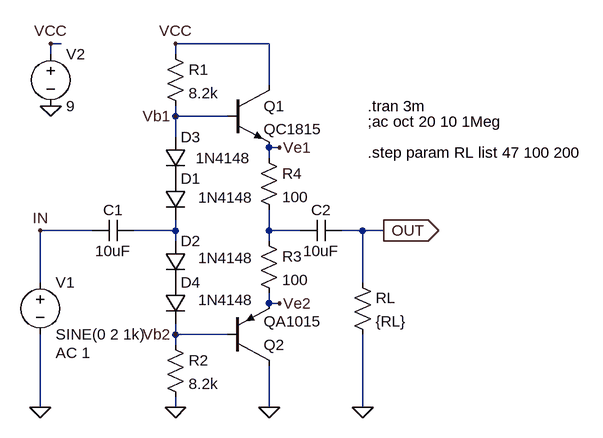
[diagram p0: schematic Push-Pull_Diode_x2_Offset.asc]
Push-Pull_Diode_x2_Offset.asc, the LTspice schematic file:
Version 4
SHEET 1 880 680
WIRE -32 -112 -48 -112
WIRE 288 -112 144 -112
WIRE -48 -96 -48 -112
WIRE 144 -96 144 -112
WIRE 288 -48 288 -112
WIRE 144 0 144 -16
WIRE 224 0 144 0
WIRE 144 32 144 0
WIRE 304 48 288 48
WIRE 288 64 288 48
WIRE 16 176 -64 176
WIRE 144 176 144 160
WIRE 144 176 80 176
WIRE 288 176 288 144
WIRE 336 176 288 176
WIRE 432 176 400 176
WIRE 464 176 432 176
WIRE 144 192 144 176
WIRE 288 192 288 176
WIRE -64 256 -64 176
WIRE 432 256 432 176
WIRE 288 288 288 272
WIRE 304 288 288 288
WIRE 144 336 144 320
WIRE 224 336 144 336
WIRE 144 352 144 336
WIRE -64 448 -64 336
WIRE 144 448 144 432
WIRE 288 448 288 384
WIRE 432 448 432 336
FLAG 144 448 0
FLAG 288 448 0
FLAG 432 448 0
FLAG -64 448 0
FLAG -48 -16 0
FLAG -48 -112 VCC
FLAG 144 -112 VCC
FLAG 464 176 OUT
IOPIN 464 176 Out
FLAG -64 176 IN
FLAG 304 48 Ve1
FLAG 144 0 Vb1
FLAG 144 336 Vb2
FLAG 304 288 Ve2
SYMBOL cap 400 160 R90
WINDOW 0 0 32 VBottom 2
WINDOW 3 32 32 VTop 2
SYMATTR InstName C2
SYMATTR Value 10uF
SYMBOL res 416 240 R0
SYMATTR InstName RL
SYMATTR Value {RL}
SYMBOL res 128 -112 R0
SYMATTR InstName R1
SYMATTR Value 8.2k
SYMBOL res 128 336 R0
SYMATTR InstName R2
SYMATTR Value 8.2k
SYMBOL cap 80 160 R90
WINDOW 0 0 32 VBottom 2
WINDOW 3 32 32 VTop 2
SYMATTR InstName C1
SYMATTR Value 10uF
SYMBOL voltage -64 240 R0
WINDOW 123 24 124 Left 2
WINDOW 39 0 0 Left 2
SYMATTR Value2 AC 1
SYMATTR InstName V1
SYMATTR Value SINE(0 2 1k)
SYMBOL voltage -48 -112 R0
WINDOW 123 0 0 Left 2
WINDOW 39 0 0 Left 2
SYMATTR InstName V2
SYMATTR Value 9
SYMBOL diode 128 96 R0
WINDOW 3 51 29 Left 2
SYMATTR Value 1N4148
SYMATTR InstName D1
SYMBOL diode 128 192 R0
WINDOW 3 51 26 Left 2
SYMATTR Value 1N4148
SYMATTR InstName D2
SYMBOL diode 128 32 R0
WINDOW 3 47 32 Left 2
SYMATTR Value 1N4148
SYMATTR InstName D3
SYMBOL diode 128 256 R0
WINDOW 3 51 27 Left 2
SYMATTR Value 1N4148
SYMATTR InstName D4
SYMBOL npn 224 -48 R0
SYMATTR InstName Q1
SYMATTR Value QC1815
SYMBOL pnp 224 384 M180
SYMATTR InstName Q2
SYMATTR Value QA1015
SYMBOL res 272 176 R0
SYMATTR InstName R3
SYMATTR Value 100
SYMBOL res 272 48 R0
SYMATTR InstName R4
SYMATTR Value 100
TEXT 440 56 Left 2 !.step param RL list 47 100 200
TEXT 440 -16 Left 2 !.tran 3m
TEXT 440 8 Left 2 !;ac oct 20 10 1Meg

The netlist it stands for:
* Push-Pull_Diode_x2_Offset.asc
C2 OUT N002 10uF
RL OUT 0 {RL}
R1 VCC Vb1 8.2k
R2 Vb2 0 8.2k
C1 N001 IN 10uF
V1 IN 0 SINE(0 2 1k) AC 1
V2 VCC 0 9
D1 P001 N001 1N4148
D2 N001 P002 1N4148
D3 Vb1 P001 1N4148
D4 P002 Vb2 1N4148
Q1 VCC Vb1 Ve1 0 QC1815
Q2 0 Vb2 Ve2 0 QA1015
R3 N002 Ve2 100
R4 Ve1 N002 100
.model D D
.lib standard.dio
.model NPN NPN
.model PNP PNP
.lib standard.bjt
.step param RL list 47 100 200
.tran 3m
;ac oct 20 10 1Meg
.backanno
.end